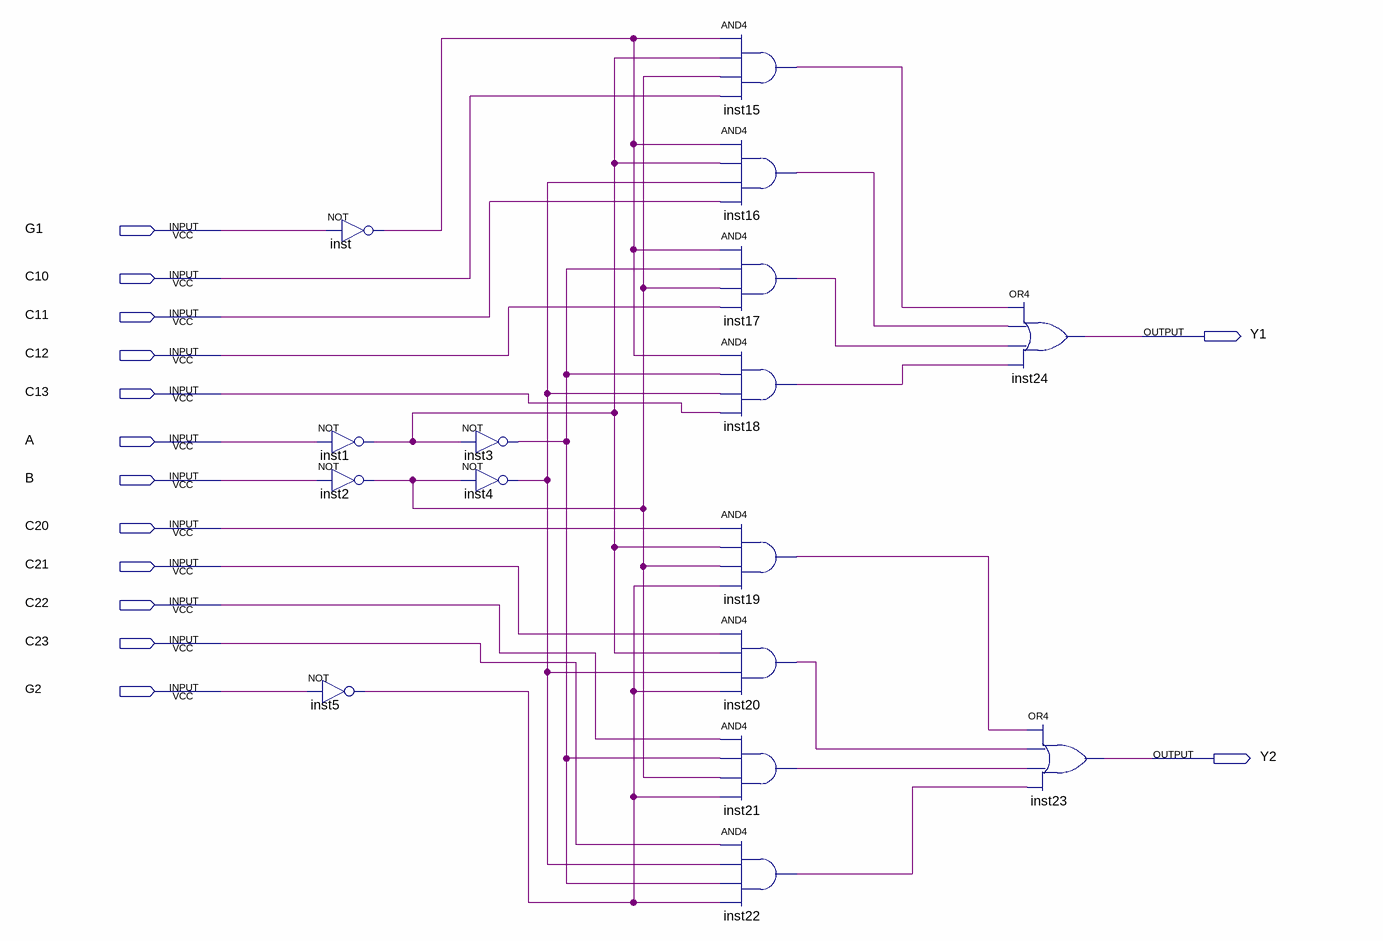
[diagram p0: schematic sheet]
// Quartus schematic 74LS153.bdf as structural Verilog: 16 symbols, 14 pins
module \74LS153  (
  input  G1,
  input  C10,
  input  C11,
  input  C12,
  input  C13,
  input  A,
  input  B,
  input  C20,
  input  C21,
  input  C22,
  input  C23,
  input  G2,
  output Y1,
  output Y2
);

  wire inst1_out, inst2_out, inst3_out, inst4_out, inst5_out, inst15_out, inst16_out, inst17_out, inst18_out,
       inst19_out, inst20_out, inst21_out, inst22_out, inst_out;

  not inst (inst_out, G1);
  not inst1 (inst1_out, A);
  not inst2 (inst2_out, B);
  not inst5 (inst5_out, G2);
  not inst3 (inst3_out, inst1_out);
  not inst4 (inst4_out, inst2_out);
  and inst15 (inst15_out, inst_out, inst1_out, inst2_out, C10);
  and inst16 (inst16_out, inst_out, inst1_out, inst4_out, C11);
  and inst17 (inst17_out, inst_out, inst3_out, inst2_out, C12);
  and inst18 (inst18_out, inst_out, inst3_out, inst4_out, C13);
  and inst19 (inst19_out, C20, inst1_out, inst2_out, inst5_out);
  and inst20 (inst20_out, C21, inst1_out, inst4_out, inst5_out);
  and inst21 (inst21_out, C22, inst3_out, inst2_out, inst5_out);
  and inst22 (inst22_out, C23, inst4_out, inst3_out, inst5_out);
  or inst24 (Y1, inst15_out, inst16_out, inst17_out, inst18_out);
  or inst23 (Y2, inst19_out, inst20_out, inst21_out, inst22_out);
endmodule
